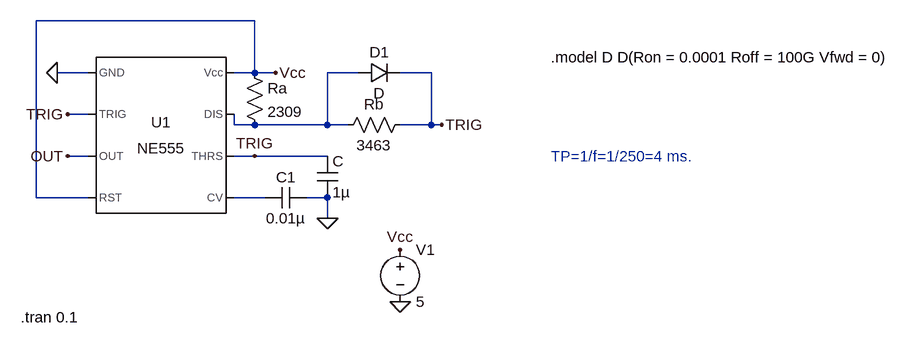
[diagram p0: schematic 2017AAPS1734H_Run3.asc]
2017AAPS1734H_Run3.asc, the LTspice schematic file:
Version 4
SHEET 1 1296 680
WIRE 272 -16 -64 -16
WIRE 16 64 -32 64
WIRE 272 64 272 -16
WIRE 272 64 240 64
WIRE 304 64 272 64
WIRE 432 64 384 64
WIRE 544 64 496 64
WIRE 16 128 -16 128
WIRE 240 144 240 128
WIRE 272 144 240 144
WIRE 384 144 384 64
WIRE 384 144 272 144
WIRE 416 144 384 144
WIRE 544 144 544 64
WIRE 544 144 496 144
WIRE 560 144 544 144
WIRE 16 192 -16 192
WIRE 272 192 240 192
WIRE 384 192 272 192
WIRE -64 256 -64 -16
WIRE 16 256 -64 256
WIRE 288 256 240 256
WIRE 384 256 352 256
WIRE 384 288 384 256
FLAG 496 416 0
FLAG 496 336 Vcc
FLAG 304 64 Vcc
FLAG -32 64 0
FLAG 384 288 0
FLAG -16 128 TRIG
FLAG 272 192 TRIG
FLAG 560 144 TRIG
FLAG -16 192 OUT
SYMBOL Misc\\NE555 128 160 R0
SYMATTR InstName U1
SYMBOL voltage 496 320 R0
WINDOW 123 0 0 Left 0
WINDOW 39 0 0 Left 0
SYMATTR InstName V1
SYMATTR Value 5
SYMBOL cap 368 192 R0
SYMATTR InstName C
SYMATTR Value 1µ
SYMBOL cap 352 240 R90
WINDOW 0 0 32 VBottom 2
WINDOW 3 32 32 VTop 2
SYMATTR InstName C1
SYMATTR Value 0.01µ
SYMBOL res 256 48 R0
SYMATTR InstName Ra
SYMATTR Value 2309
SYMBOL res 512 128 R90
WINDOW 0 0 56 VBottom 2
WINDOW 3 32 56 VTop 2
SYMATTR InstName Rb
SYMATTR Value 3463
SYMBOL diode 432 80 R270
WINDOW 0 32 32 VTop 2
WINDOW 3 0 32 VBottom 2
SYMATTR InstName D1
TEXT -88 440 Left 2 !.tran 0.1
TEXT 728 40 Left 2 !.model D D(Ron = 0.0001 Roff = 100G Vfwd = 0)
TEXT 728 192 Left 2 ;TP=1/f=1/250=4 ms.

The netlist it stands for:
* 2017AAPS1734H_Run3.asc
XU1 0 TRIG OUT Vcc N002 TRIG N001 Vcc NE555  ; pins GND TRIG OUT RST CV THRS DIS Vcc
V1 Vcc 0 5
C TRIG 0 1µ
C1 0 N002 0.01µ
Ra Vcc N001 2309
Rb TRIG N001 3463
D1 N001 TRIG D
.model D D
.lib standard.dio
.tran 0.1
.model D D(Ron = 0.0001 Roff = 100G Vfwd = 0)
* TP=1/f=1/250=4 ms.
.lib NE555.sub
.backanno
.end